# Altium schematic sheet WirelessStepperMotorController.SchDoc
size A2
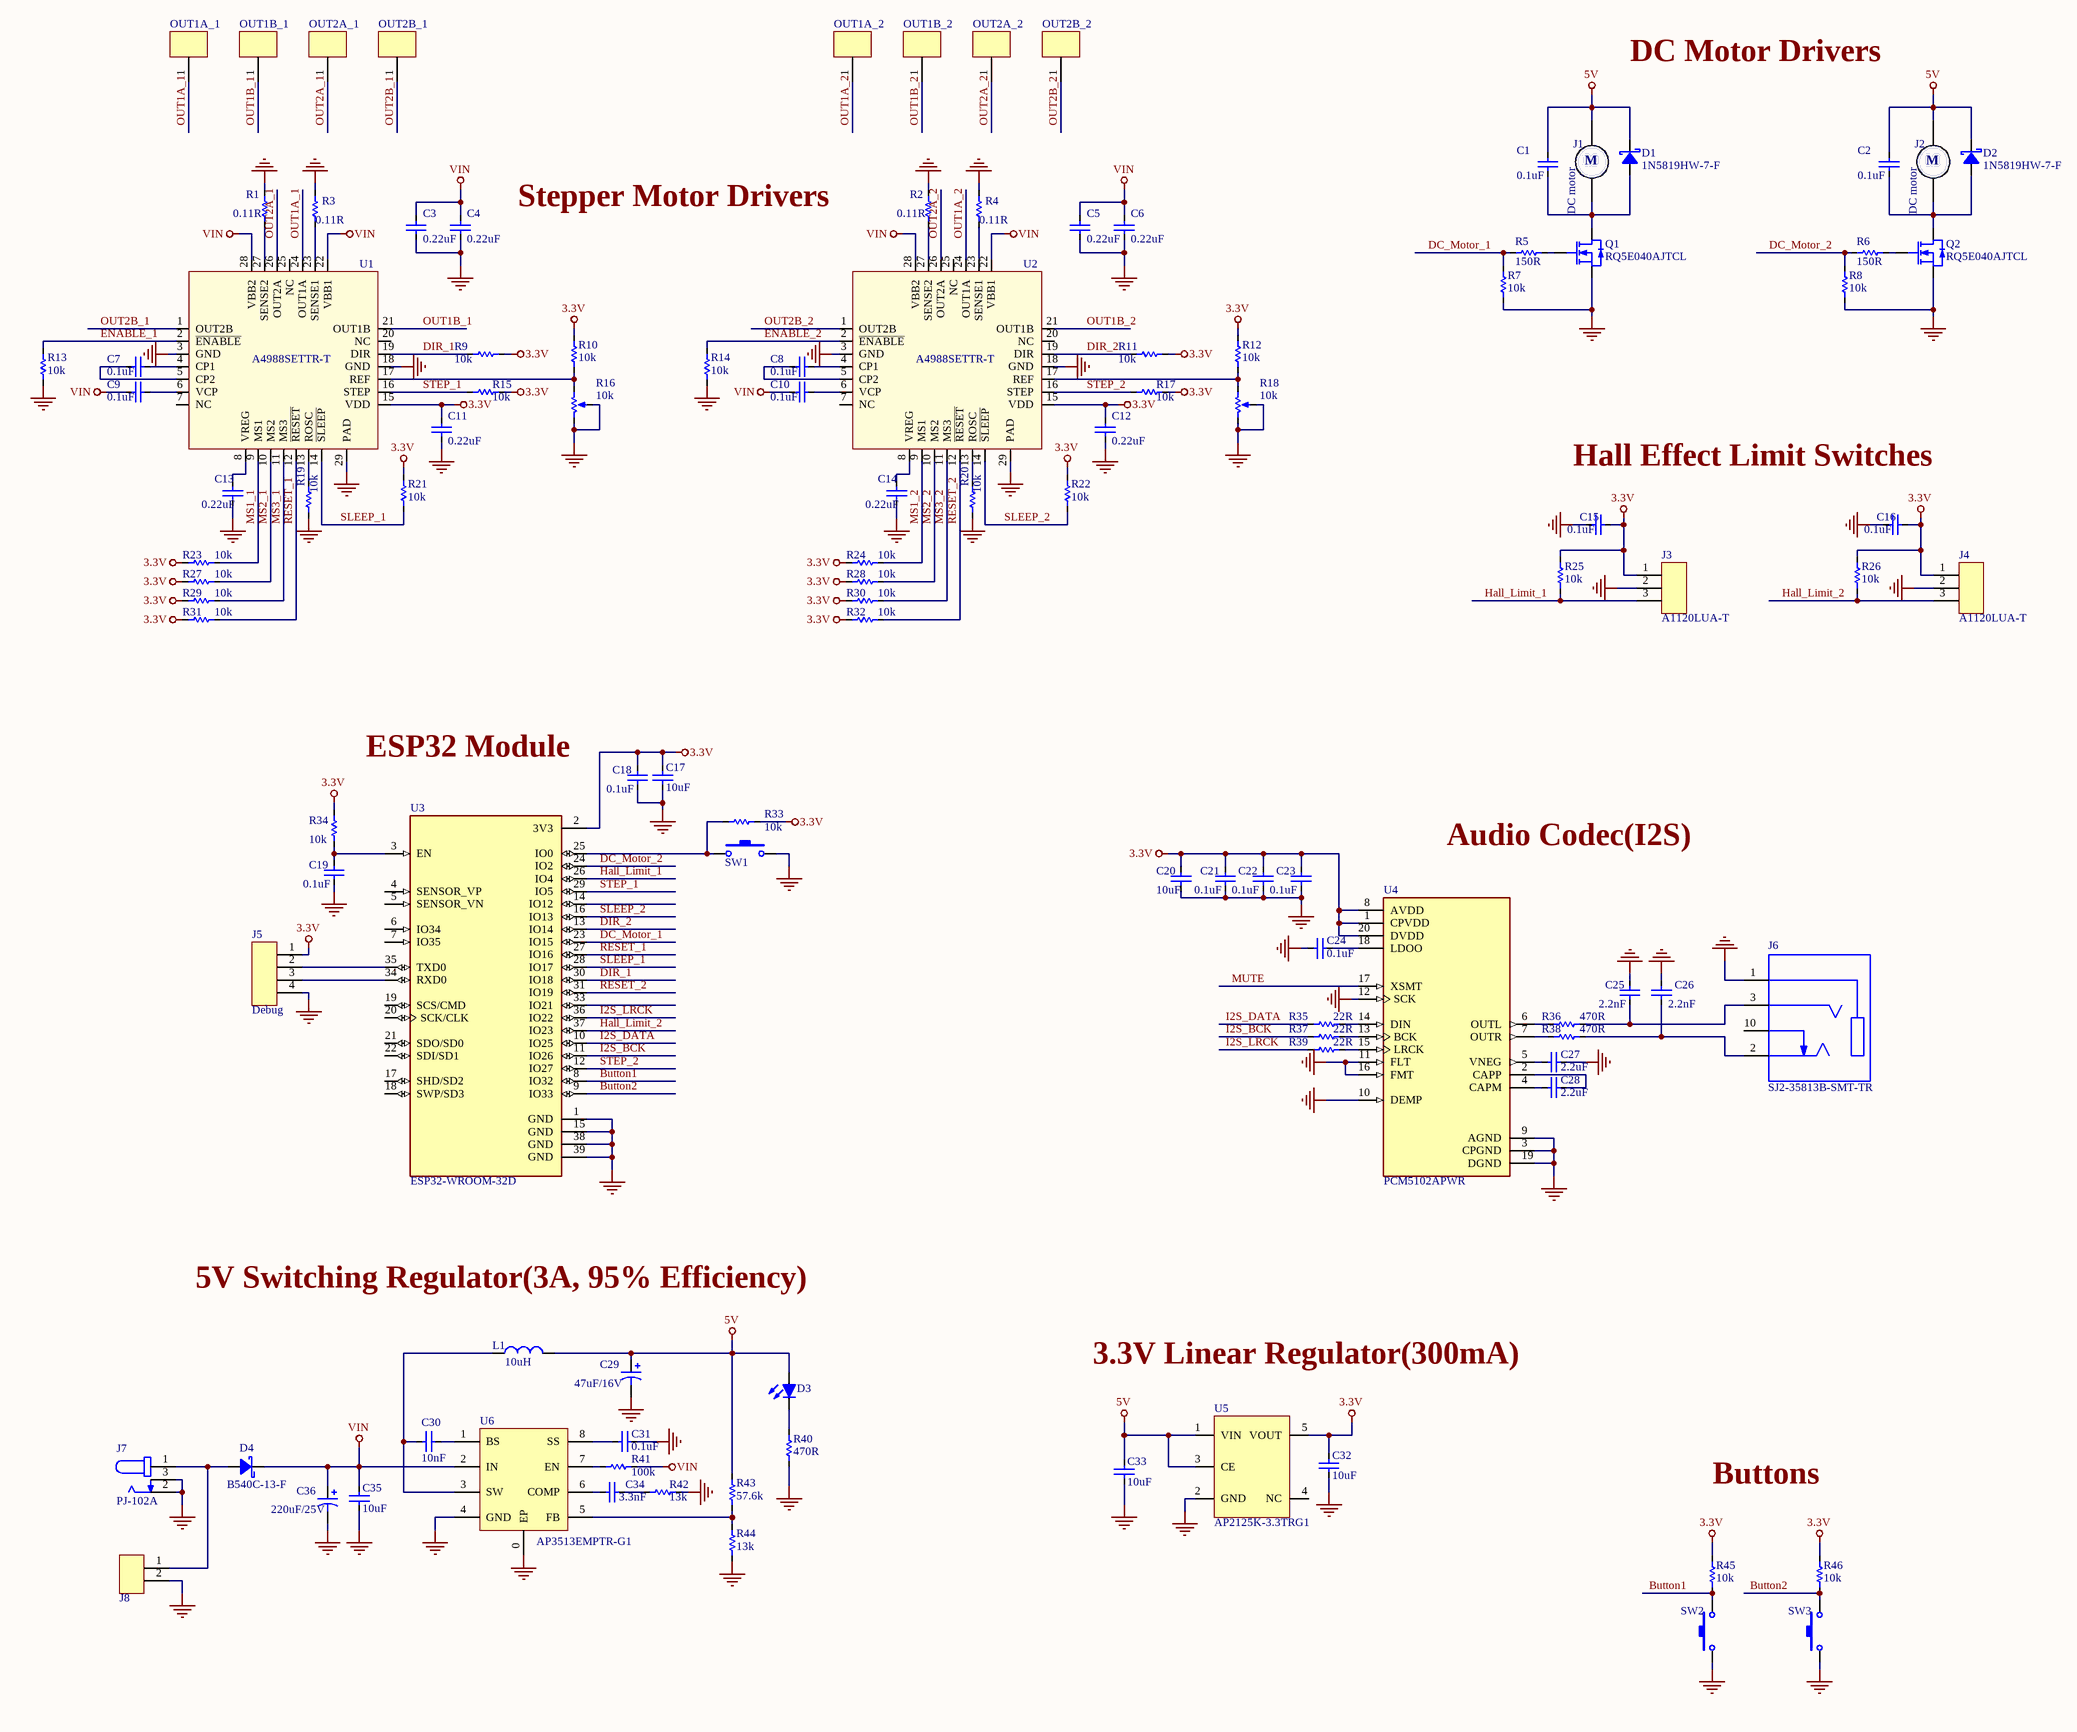
[diagram p0: WirelessStepperMotorController.SchDoc]

## Parts
C1  0.1uF  [SMD_C(0603)]
C2  0.1uF  [SMD_C(0603)]
C3  0.22uF  [SMD_C(0603)]
C4  0.22uF  [SMD_C(0603)]
C5  0.22uF  [SMD_C(0603)]
C6  0.22uF  [SMD_C(0603)]
C7  0.1uF  [SMD_C(0603)]
C8  0.1uF  [SMD_C(0603)]
C9  0.1uF  [SMD_C(0603)]
C10  0.1uF  [SMD_C(0603)]
C11  0.22uF  [SMD_C(0603)]
C12  0.22uF  [SMD_C(0603)]
C13  0.22uF  [SMD_C(0603)]
C14  0.22uF  [SMD_C(0603)]
C15  0.1uF  [SMD_C(0603)]
C16  0.1uF  [SMD_C(0603)]
C17  10uF  [SMD_C(0805)]
C18  0.1uF  [SMD_C(0603)]
C19  0.1uF  [SMD_C(0603)]
C20  10uF  [SMD_C(0805)]
C21  0.1uF  [SMD_C(0603)]
C22  0.1uF  [SMD_C(0603)]
C23  0.1uF  [SMD_C(0603)]
C24  0.1uF  [SMD_C(0603)]
C25  2.2nF  [SMD_C(0603)]
C26  2.2nF  [SMD_C(0603)]
C27  2.2uF  [SMD_C(0603)]
C28  2.2uF  [SMD_C(0603)]
C29  47uF/16V  [CAPAE660X800N]
C30  10nF  [SMD_C(0603)]
C31  0.1uF  [SMD_C(0603)]
C32  10uF  [SMD_C(0805)]
C33  10uF  [SMD_C(0805)]
C34  3.3nF  [SMD_C(0603)]
C35  10uF  [SMD_C(0805)]
C36  220uF/25V  [CAPAE830X1000N]
D1  1N5819HW-7-F  [SOD-123]
D2  1N5819HW-7-F  [SOD-123]
D3  SML-D12U1WT86  [SMD_LED(0603)]  (value not drawn)
D4  B540C-13-F  [DO-214AB]
J1  DC motor  [Header-2.54m-2pin_1]
J2  DC motor  [Header-2.54m-2pin_1]
J3  A1120LUA-T  [Header-2.54m-3pin_1]
J4  A1120LUA-T  [Header-2.54m-3pin_1]
J5  Debug  [Header-2.54m-4pin]
J6  SJ2-35813B-SMT-TR  [CUI_SJ2-35813B-SMT-TR]
J7  PJ-102A  [CUI_PJ-102A]
J8  2 Pin Connector  [Header-2.54m-2pin_2]  (value not drawn)
L1  10uH  [IND_NRS5040]
OUT1A_1  Terminal  [Header-2.54m-1pin]  (value not drawn)
OUT1A_2  Terminal  [Header-2.54m-1pin]  (value not drawn)
OUT1B_1  Terminal  [Header-2.54m-1pin]  (value not drawn)
OUT1B_2  Terminal  [Header-2.54m-1pin]  (value not drawn)
OUT2A_1  Terminal  [Header-2.54m-1pin]  (value not drawn)
OUT2A_2  Terminal  [Header-2.54m-1pin]  (value not drawn)
OUT2B_1  Terminal  [Header-2.54m-1pin]  (value not drawn)
OUT2B_2  Terminal  [Header-2.54m-1pin]  (value not drawn)
Q1  RQ5E040AJTCL  [SC-96]
Q2  RQ5E040AJTCL  [SC-96]
R1  0.11R  [SMD_R(1206)]
R2  0.11R  [SMD_R(1206)]
R3  0.11R  [SMD_R(1206)]
R4  0.11R  [SMD_R(1206)]
R5  150R  [SMD_R(0603)]
R6  150R  [SMD_R(0603)]
R7  10k  [SMD_R(0603)]
R8  10k  [SMD_R(0603)]
R9  10k  [SMD_R(0603)]
R10  10k  [SMD_R(0603)]
R11  10k  [SMD_R(0603)]
R12  10k  [SMD_R(0603)]
R13  10k  [SMD_R(0603)]
R14  10k  [SMD_R(0603)]
R15  10k  [SMD_R(0603)]
R16  10k  [TRIM_TC33X-2-103E]
R17  10k  [SMD_R(0603)]
R18  10k  [TRIM_TC33X-2-103E]
R19  10k  [SMD_R(0603)]
R20  10k  [SMD_R(0603)]
R21  10k  [SMD_R(0603)]
R22  10k  [SMD_R(0603)]
R23  10k  [SMD_R(0603)]
R24  10k  [SMD_R(0603)]
R25  10k  [SMD_R(0603)]
R26  10k  [SMD_R(0603)]
R27  10k  [SMD_R(0603)]
R28  10k  [SMD_R(0603)]
R29  10k  [SMD_R(0603)]
R30  10k  [SMD_R(0603)]
R31  10k  [SMD_R(0603)]
R32  10k  [SMD_R(0603)]
R33  10k  [SMD_R(0603)]
R34  10k  [SMD_R(0603)]
R35  22R  [SMD_R(0603)]
R36  470R  [SMD_R(0603)]
R37  22R  [SMD_R(0603)]
R38  470R  [SMD_R(0603)]
R39  22R  [SMD_R(0603)]
R40  470R  [SMD_R(0603)]
R41  100k  [SMD_R(0603)]
R42  13k  [SMD_R(0603)]
R43  57.6k  [SMD_R(0603)]
R44  13k  [SMD_R(0603)]
R45  10k  [SMD_R(0603)]
R46  10k  [SMD_R(0603)]
SW1  TL1015AF160QG  [SW_TL1015AF160QG]  (value not drawn)
SW2  TL1015AF160QG  [SW_TL1015AF160QG]  (value not drawn)
SW3  TL1015AF160QG  [SW_TL1015AF160QG]  (value not drawn)
U1  A4988SETTR-T  [QFN28G_0.5-5X5MM]
U2  A4988SETTR-T  [QFN28G_0.5-5X5MM]
U3  ESP32-WROOM-32D  [MODULE_ESP32-WROOM-32D]
U4  PCM5102APWR  [TSSOP-20N]
U5  AP2125K-3.3TRG1  [SOT23-5]
U6  AP3513EMPTR-G1  [SOIC-8(EP)]

## Nets
3.3V: C11.2 C12.2 C15.1 C16.1 C17.2 C18.1 C20.2 C21.1 C22.1 C23.1 C32.2 J3.1 J4.1 J5.1 R9.2 R10.2 R11.2 R12.2 R15.2 R17.2 R21.2 R22.2 R23.2 R24.2 R25.1 R26.1 R27.2 R28.2 R29.2 R30.2 R31.2 R32.2 R33.2 R34.1 R45.2 R46.2 U1.15(VDD) U2.15(VDD) U3.2(3V3) U4.1(CPVDD) U4.8(AVDD) U4.20(DVDD) U5.5(VOUT)
5V: C1.1 C2.1 C29.1 C33.2 D1.K D2.K D3.1(A) J1.1 J2.1 L1.2 R43.1 U5.1(VIN) U5.3(CE)
GND: C3.1 C4.1 C5.1 C6.1 C11.1 C12.1 C13.1 C14.1 C15.2 C16.2 C17.1 C18.2 C19.2 C20.1 C21.2 C22.2 C23.2 C24.1 C25.2 C26.2 C27.2 C29.2 C31.2 C32.1 C33.1 C35.1 C36.2 J3.2 J4.2 J5.4 J6.1(SLEEVE) J7.2 J7.3 J8.2 Q1.2(S) Q2.2(S) R1.2 R2.2 R3.2 R4.2 R7.2 R8.2 R13.1 R14.1 R16.2(TAP) R16.3(BOT) R18.2(TAP) R18.3(BOT) R19.1 R20.1 R40.1 R42.2 R44.2 SW1.2 SW2.1 SW3.1 U1.3(GND) U1.18(GND) U1.29(PAD) U2.3(GND) U2.18(GND) U2.29(PAD) U3.1(GND) U3.15(GND) U3.38(GND) U3.39(GND) U4.3(CPGND) U4.9(AGND) U4.10(DEMP) U4.11(FLT) U4.12(SCK) U4.16(FMT) U4.19(DGND) U5.2(GND) U6.0(EP) U6.4(GND)
VIN: C3.2 C4.2 C5.2 C6.2 C9.2 C10.2 C35.2 C36.1 D4.K R41.2 U1.22(VBB1) U1.28(VBB2) U2.22(VBB1) U2.28(VBB2) U6.2(IN)
Button1: R45.1 SW2.2 U3.8(IO32)
Button2: R46.1 SW3.2 U3.9(IO33)
DC_Motor_1: R5.1 R7.1 U3.23(IO15)
DC_Motor_2: R6.1 R8.1 U3.24(IO2)
DIR_1: R9.1 U1.19(DIR) U3.30(IO18)
DIR_2: R11.1 U2.19(DIR) U3.13(IO14)
ENABLE_1: R13.2 U1.2(~{ENABLE})
ENABLE_2: R14.2 U2.2(~{ENABLE})
Hall_Limit_1: J3.3 R25.2 U3.26(IO4)
Hall_Limit_2: J4.3 R26.2 U3.37(IO23)
I2S_BCK: R37.1 U3.11(IO26)
I2S_DATA: R35.1 U3.10(IO25)
I2S_LRCK: R39.1 U3.36(IO22)
MS1_1: R23.1 U1.9(MS1)
MS1_2: R24.1 U2.9(MS1)
MS2_1: R27.1 U1.10(MS2)
MS2_2: R28.1 U2.10(MS2)
MS3_1: R29.1 U1.11(MS3)
MS3_2: R30.1 U2.11(MS3)
MUTE: U4.17(XSMT)
OUT1A_1: OUT1A_1.1 U1.24(OUT1A)
OUT1A_2: OUT1A_2.1 U2.24(OUT1A)
OUT1B_1: OUT1B_1.1 U1.21(OUT1B)
OUT1B_2: OUT1B_2.1 U2.21(OUT1B)
OUT2A_1: OUT2A_1.1 U1.26(OUT2A)
OUT2A_2: OUT2A_2.1 U2.26(OUT2A)
OUT2B_1: OUT2B_1.1 U1.1(OUT2B)
OUT2B_2: OUT2B_2.1 U2.1(OUT2B)
RESET_1: R31.1 U1.12(~{RESET}) U3.27(IO16)
RESET_2: R32.1 U2.12(~{RESET}) U3.31(IO19)
SLEEP_1: R21.1 U1.14(~{SLEEP}) U3.28(IO17)
SLEEP_2: R22.1 U2.14(~{SLEEP}) U3.16(IO13)
STEP_1: R15.1 U1.16(STEP) U3.29(IO5)
STEP_2: R17.1 U2.16(STEP) U3.12(IO27)
NetC1_2: C1.2 D1.A J1.2 Q1.3(D)
NetC2_2: C2.2 D2.A J2.2 Q2.3(D)
NetC7_1: C7.1 U1.4(CP1)
NetC7_2: C7.2 U1.5(CP2)
NetC8_1: C8.1 U2.4(CP1)
NetC8_2: C8.2 U2.5(CP2)
NetC9_1: C9.1 U1.6(VCP)
NetC10_1: C10.1 U2.6(VCP)
NetC13_2: C13.2 U1.8(VREG)
NetC14_2: C14.2 U2.8(VREG)
NetC19_1: C19.1 R34.2 U3.3(EN)
NetC24_2: C24.2 U4.18(LDOO)
NetC25_1: C25.1 J6.3(RING) R36.2
NetC26_1: C26.1 J6.2(TIP) R38.2
NetC27_1: C27.1 U4.5(VNEG)
NetC28_1: C28.1 U4.4(CAPM)
NetC28_2: C28.2 U4.2(CAPP)
NetC30_1: C30.1 U6.1(BS)
NetC30_2: C30.2 L1.1 U6.3(SW)
NetC31_1: C31.1 U6.8(SS)
NetC34_1: C34.1 U6.6(COMP)
NetC34_2: C34.2 R42.1
NetD3_2: D3.2(K) R40.2
NetD4_A: D4.A J7.1 J8.1
NetJ5_2: J5.2 U3.35(TXD0)
NetJ5_3: J5.3 U3.34(RXD0)
NetQ1_1: Q1.1(G) R5.2
NetQ2_1: Q2.1(G) R6.2
NetR1_1: R1.1 U1.27(SENSE2)
NetR2_1: R2.1 U2.27(SENSE2)
NetR3_1: R3.1 U1.23(SENSE1)
NetR4_1: R4.1 U2.23(SENSE1)
NetR10_1: R10.1 R16.1(TOP) U1.17(REF)
NetR12_1: R12.1 R18.1(TOP) U2.17(REF)
NetR19_2: R19.2 U1.13(ROSC)
NetR20_2: R20.2 U2.13(ROSC)
NetR33_1: R33.1 SW1.1 U3.25(IO0)
NetR35_2: R35.2 U4.14(DIN)
NetR36_1: R36.1 U4.6(OUTL)
NetR37_2: R37.2 U4.13(BCK)
NetR38_1: R38.1 U4.7(OUTR)
NetR39_2: R39.2 U4.15(LRCK)
NetR41_1: R41.1 U6.7(EN)
NetR43_2: R43.2 R44.1 U6.5(FB)

Not connected (* = marked no-connect by the designer): J6 10(TIP_SWITCH); U1 7(NC) 20(NC) 25(NC); U2 7(NC) 20(NC) 25(NC); U3 4(SENSOR_VP) 5(SENSOR_VN) 6(IO34) 7(IO35) 14(IO12) 17(SHD/SD2) 18(SWP/SD3) 19(SCS/CMD) 20(SCK/CLK) 21(SDO/SD0) 22(SDI/SD1) 33(IO21); U5 4(NC)

## Notes on the sheet
- DC Motor Drivers
- Stepper Motor Drivers
- Hall Effect Limit Switches
- ESP32 Module
- Audio Codec(I2S)
- 5V Switching Regulator(3A, 95% Efficiency)
- 3.3V Linear Regulator(300mA)
- Buttons
- (in symbol DC motor) M

## Library data of the parts
C1 C2 C7-C10 C15 C16 C18 C19 C21-C24 C31 = Cap: 0.1µF ±10% 25V; Manufacturer: Yageo; Manufacturer Part Number: CC0603KRX7R8BB104; Supplier: Digi-Key; Supplier Part Number: 311-1341-1-ND; Value: 0.1uF
C3-C6 C11-C14 = Cap: 0.22µF ±10% 25V; Manufacturer: Yageo; Manufacturer Part Number: CC0603KRX7R8BB224; Supplier: Digi-Key; Supplier Part Number: 311-1803-1-ND; Value: 0.22uF
C17 C20 C32 C33 C35 = Cap: 10µF ±10% 25V; Manufacturer: Murata; Manufacturer Part Number: GRM21BR61E106KA73K; Supplier: Digi-Key; Supplier Part Number: 490-16824-1-ND; Vaule: 10uF
C25 C26 = Cap: 2200pF ±10% 25V; Manufacturer: Yageo; Manufacturer Part Number: CC0603KRX7R8BB222; Supplier: Digi-Key; Supplier Part Number: 311-3653-1-ND; Value: 2.2nF
C27 C28 = Cap: 2.2µF ±10% 25V; Manufacturer: Yageo; Manufacturer Part Number: CC0603KRX5R8BB225; Supplier: Digi-Key; Supplier Part Number: 311-1786-1-ND; Value: 2.2uF
C29 = Cap Pol1: CAP ALUM 47UF 20% 16V SMD; Manufacturer Part Number: UWX1C470MCL1GB; Manufacturer: Nichicon; Supplier: Digi-Key; Supplier Part Number: 493-2103-1-ND; Value: 47uF/16V
C30 = Cap: 10nF ±10% 50V; Manufacturer: Yageo; Manufacturer Part Number: CC0603KPX7R9BB103; Value: 10nF; Supplier: Digi-Key; Supplier Part Number: 311-1572-1-ND
C34 = Cap: 3300pF ±10% 25V; Manufacturer: Yageo; Manufacturer Part Number: CC0603KRX7R8BB332; Value: 3.3nF; Supplier Part Number: 311-4084-1-ND; Supplier: Digi-Key
C36 = Cap Pol1: CAP ALUM 220UF 20% 25V SMD; Manufacturer Part Number: UUD1E221MNL1GS; Manufacturer: Nichicon; Supplier: Digi-Key; Supplier Part Number: 493-2278-1-ND; Value: 220uF/25V
D1 D2 = Diode 10TQ035: DIODE SCHOTTKY 40V 1A SOD123; Manufacturer: Diodes; Value: 1N5819HW-7-F; Manufacturer Part Number: 1N5819HW-7-F; Supplier: Digi-Key; Supplier Part Number: 1N5819HW-FDICT-ND
D3 = LED1: Typical RED GaAs LED; Manufacturer: Rohm Semiconductor; Supplier: Digi-Key; Supplier Part Number: SML-D12U1WT86CT-ND; Manufacturer Part Number: SML-D12U1WT86; Value: SML-D12U1WT86
D4 = Diode 10TQ035: DIODE SCHOTTKY 40V 5A SMC; Manufacturer: Diodes; Value: B540C-13-F; Manufacturer Part Number: B540C-13-F; Supplier: Digi-Key; Supplier Part Number: B540C-FDICT-ND
J3 J4 = 3PinConnector: MAGNETIC SWITCH UNIPOLAR 3SIP; Manufacturer: Allegro MicroSystems; Manufacturer Part Number: A1120LUA-T; Value: A1120LUA-T; Supplier: Digi-Key; Supplier Part Number: 620-1330-ND
J5 = 4PinConnector
J6 = SJ2-35813B-SMT-TR: AUDIO JACK, 3.5 MM, RT, 3 CONDUC; Manufacturer: CUI Devices; Supplier: Digi-Key; Supplier Part Number: CP-SJ2-35813B-SMT-CT-ND; Value: SJ2-35813B-SMT-TR; Manufacturer Part Number: SJ2-35813B-SMT-TR
J7 = PJ-102A: CONN PWR JACK 2X5.5MM SOLDER; Manufacturer: CUI Devices; Manufacturer Part Number: PJ-102A; Value: PJ-102A; Supplier: Digi-Key; Supplier Part Number: CP-102A-ND
J8 = 2PinConnector
L1 = Inductor: FIXED IND 10UH 2.1A 72.8 MOHM; Manufacturer Part Number: NRS5040T100MMGJ; Manufacturer: Taiyo Yuden; Supplier: Digi-Key; Supplier Part Number: 587-NRS5040T100MMGJCT-ND; Value: 10uH
Q1 Q2 = MOSFET-N: MOSFET N-CH 30V 4A TSMT3; Manufacturer: Rohm Semiconductor; Manufacturer Part Number: RQ5E040AJTCL; Value: RQ5E040AJTCL; Supplier: Digi-Key; Supplier Part Number: RQ5E040AJTCLCT-ND
R1-R4 = Res Semi: 110 mOhms ±1% 0.25W; Manufacturer: Yageo; Manufacturer Part Number: RL1206FR-070R11L; Value: 0.11R; Supplier: Digi-Key; Supplier Part Number: 311-.11LWCT-ND
R5 R6 = Res Semi: 150 Ohms ±1% 0.1W; Manufacturer: Yageo; Manufacturer Part Number: RC0603FR-07150RL; Value: 150R; Supplier: Digi-Key; Supplier Part Number: 311-150HRCT-ND
R7-R15 R17 R19-R34 R45 R46 = Res Semi: 10 kOhms ±1% 0.1W; Manufacturer: Yageo; Manufacturer Part Number: RC0603FR-0710KL; Value: 10k; Supplier: Digi-Key; Supplier Part Number: 311-10.0KHRCT-ND
R16 R18 = RPot: Potentiometer; Manufacturer Part Number: TC33X-2-103E; Manufacturer: Bourns; Value: 10k; Supplier: Digi-Key; Supplier Part Number: TC33X-103ECT-ND
R35 R37 R39 = Res Semi: 22 Ohms ±1% 0.1W; Manufacturer: Yageo; Manufacturer Part Number: RC0603FR-0722RL; Value: 22R; Supplier: Digi-Key; Supplier Part Number: 311-22.0HRCT-ND
R36 R38 R40 = Res Semi: 470 Ohms ±1% 0.1W; Manufacturer: Yageo; Manufacturer Part Number: RC0603FR-07470RL; Value: 470R; Supplier: Digi-Key; Supplier Part Number: 311-470HRCT-ND
R41 = Res Semi: 10 kOhms ±1% 0.1W; Manufacturer: Yageo; Manufacturer Part Number: RC0603FR-07100KL; Value: 100k; Supplier: Digi-Key; Supplier Part Number: 311-100KHRCT-ND
R42 = Res Semi: 13 kOhms ±1% 0.1W; Manufacturer: Yageo; Manufacturer Part Number: RC0603FR-0713KL; Value: 13k; Supplier: Digi-Key; Supplier Part Number: 311-13.0KHRCT-ND
R43 = Res Semi: 93.1kOhms ±1% 0.1W; Manufacturer: Yageo; Manufacturer Part Number: RC0603FR-0757K6L; Supplier: Digi-Key; Supplier Part Number: 311-57.6KHRCT-ND; Value: 57.6k
R44 = Res Semi: 13kOhms ±1% 0.1W; Manufacturer: Yageo; Manufacturer Part Number: RC0603FR-0713KL
SW1-SW3 = SW-PB: SWITCH TACTILE SPST-NO 0.05A 12V; Manufacturer: E-Switch; Value: TL1015AF160QG; Manufacturer Part Number: TL1015AF160QG; Supplier: Digi-Key; Supplier Part Number: EG4344CT-ND
U1 U2 = DRIVER-A4988SETTR-T(QFN28): Bipolar Motor Driver DMOS Logic 28-QFN _5x5_; Manufacturer: Allegro MicroSystems LLC; Value: A4988SETTR-T; Manufacturer Part Number: A4988SETTR-T; Supplier: Digi-Key; Supplier Part Number: 620-1343-1-ND
U3 = ESP32-WROOM-32D: Bluetooth, WiFi 802.11b/g/n, Bluetooth v4.2 + EDR, Class 1, 2 and 3 Transceiver Module 2.4GHz ~ 2.5GHz Integrated, Trace Surface Mount; Manufacturer: Espressif Systems; Value: ESP32-WROOM-32D; Manufacturer Part Number: ESP32-WROOM-32D; Supplier: Digi-Key; Supplier Part Number: 1965-ESP32-WROOM-32D(4MB)CT-ND
U4 = PCM5102APWR: 2VRMS DirectPath, 112dB Audio Stereo DAC with 32-bit, 384kHz PCM Interface 20-TSSOP -25 to 85; Manufacturer: Texas Instruments; Manufacturer Part Number: PCM5102APWR; Value: PCM5102APWR; Supplier: Digi-Key; Supplier Part Number: 296-36707-1-ND
U5 = AP2125K-2.8TRG1: IC REG LINEAR 2.8V 300MA SOT23-5; Manufacturer: Diodes Incorporated; Manufacturer Part Number: AP2125K-3.3TRG1; Supplier: Digi-Key; Supplier Part Number: AP2125K-3.3TRG1DICT-ND; Value: AP2125K-3.3TRG1
U6 = AP3513EMPTR-G1: IC REG BUCK ADJUSTABLE 3A 8SO; Manufacturer: Diodes; Manufacturer Part Number: AP3513EMPTR-G1; Supplier: Digi-Key; Supplier Part Number: AP3513EMPTR-G1DICT-ND; Value: AP3513EMPTR-G1